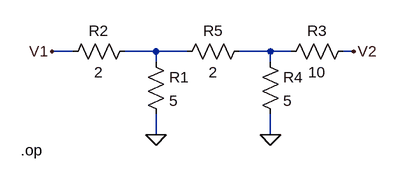
[diagram p0: schematic ejemplo7.asc]
ejemplo7.asc, the LTspice schematic file:
Version 4
SHEET 1 880 680
WIRE 64 144 32 144
WIRE 192 144 144 144
WIRE 240 144 192 144
WIRE 368 144 320 144
WIRE 400 144 368 144
WIRE 496 144 480 144
WIRE 192 160 192 144
WIRE 368 160 368 144
WIRE 192 272 192 240
WIRE 368 272 368 240
FLAG 192 272 0
FLAG 496 144 V2
FLAG 32 144 V1
FLAG 368 272 0
SYMBOL res 176 144 R0
SYMATTR InstName R1
SYMATTR Value 5
SYMBOL res 160 128 R90
WINDOW 0 0 56 VBottom 2
WINDOW 3 32 56 VTop 2
SYMATTR InstName R2
SYMATTR Value 2
SYMBOL res 496 128 R90
WINDOW 0 0 56 VBottom 2
WINDOW 3 32 56 VTop 2
SYMATTR InstName R3
SYMATTR Value 10
SYMBOL res 352 144 R0
SYMATTR InstName R4
SYMATTR Value 5
SYMBOL res 336 128 R90
WINDOW 0 0 56 VBottom 2
WINDOW 3 32 56 VTop 2
SYMATTR InstName R5
SYMATTR Value 2
TEXT -16 296 Left 2 !.op

The netlist it stands for:
* ejemplo7.asc
R1 N001 0 5
R2 N001 V1 2
R3 V2 N002 10
R4 N002 0 5
R5 N002 N001 2
.op
.backanno
.end